# Altium schematic sheet v010 connector schematics.SchDoc
size A4
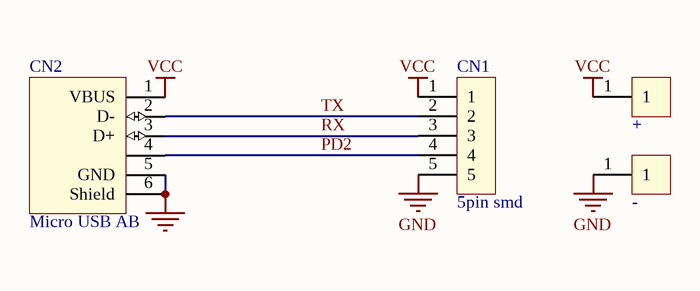
[diagram p0: v010 connector schematics.SchDoc]

## Parts
+  No component mounted  [SU01LS]  (value not drawn)
-  No component mounted  [SU01LS]  (value not drawn)
CN1  5pin smd  [SU05LSR - 1MM]
CN2  Micro USB AB  [Micro USB Receptacle smaller]

## Nets
GND: -.1 CN1.5 CN2.5(GND) CN2.6(Shield)
VCC: +.1 CN1.1 CN2.1(VBUS)
PD2: CN1.4 CN2.4
RX: CN1.3 CN2.3(D+)
TX: CN1.2 CN2.2(D-)

## Library data of the parts
+ - = 1pin smd
CN1 = 5pin smd: No component mounted
CN2 = micro usb: Connector Receptacle Micro USB AB SMD Reverse Angle; Manufacturer: Hirose Electric; Manufacturer Description: CONN RCPT MICRO USB AB SMD R/A; Manufacturer Part Number: ZX62-AB-5PA(11); Digi-Key Part Number: H11635CT-ND